# EAGLE schematic main (EAGLE 7.6.0)
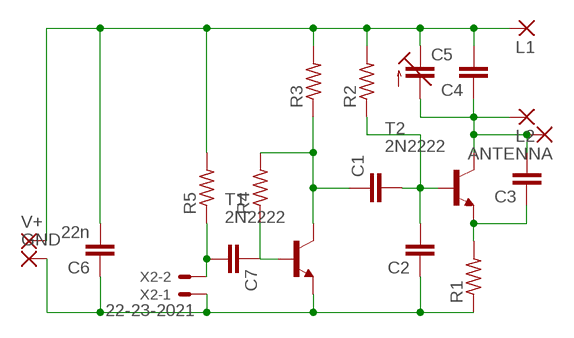
[diagram p0: schematic, sheet 1]

## Parts
ANTENNA  2,15/1,0  [2,15/1,0]
C1  C2.5/4  [C2.5-4]
C2  C2.5/4  [C2.5-4]
C3  C2.5/4  [C2.5-4]
C4  C2.5/4  [C2.5-4]
C5  C-TRIMM3050.504  [CTRIM3050.504]
C6  22n  C2.5/4  [C2.5-4]
C7  C2.5/4  [C2.5-4]
GND  2,15/1,0  [2,15/1,0]
L1  2,15/1,0  [2,15/1,0]
L2  2,15/1,0  [2,15/1,0]
R1  R-US_0204/2V  [0204V]
R2  R-US_0204/2V  [0204V]
R3  R-US_0204/2V  [0204V]
R4  R-US_0204/2V  [0204V]
R5  R-US_0204/2V  [0204V]
T1  2N2222  [TO92-EBC-OVAL]
T2  2N2222  [TO92-EBC-OVAL]
V+  2,15/1,0  [2,15/1,0]
X2  22-23-2021  [22-23-2021]

## Nets
N$2: ANTENNA.1(P) C3.2 C4.1 C5.2(A) L2.1(P) T2.C
N$3: C3.1 R1.2 T2.E
N$4: C1.2 C2.2 R2.1 T2.B
N$5: C2.1 C6.1 GND.1(P) R1.1 T1.E X2.1
N$7: C1.1 R3.1 R4.2 T1.C
N$9: C7.1 R4.1 T1.B
N$10: C7.2 R5.1 X2.2
N$15: C4.2 C5.1(E) C6.2 L1.1(P) R2.2 R3.2 R5.2 V+.1(P)

## Library data of the parts
ANTENNA GND L1 L2 V+ = wirepad:2,15/1,0: THROUGH-HOLE PAD
C1-C4 C6 C7 = capacitor-wima:C: CAPACITOR naming: grid - package width
C5 = resistor:C-TRIMM: Trimm capacitor
R1-R5 = adafruit:R-US_: RESISTOR, American symbol
T1 T2 = adafruit:2N2222: NPN TRANSISTOR Big oval pads
X2 = con-molex:22-23-2021: .100" (2.54mm) Center Header - 2 Pin; MF: MOLEX; MPN: 22-23-2021; OC_FARNELL: 1462926; OC_NEWARK: 25C3832